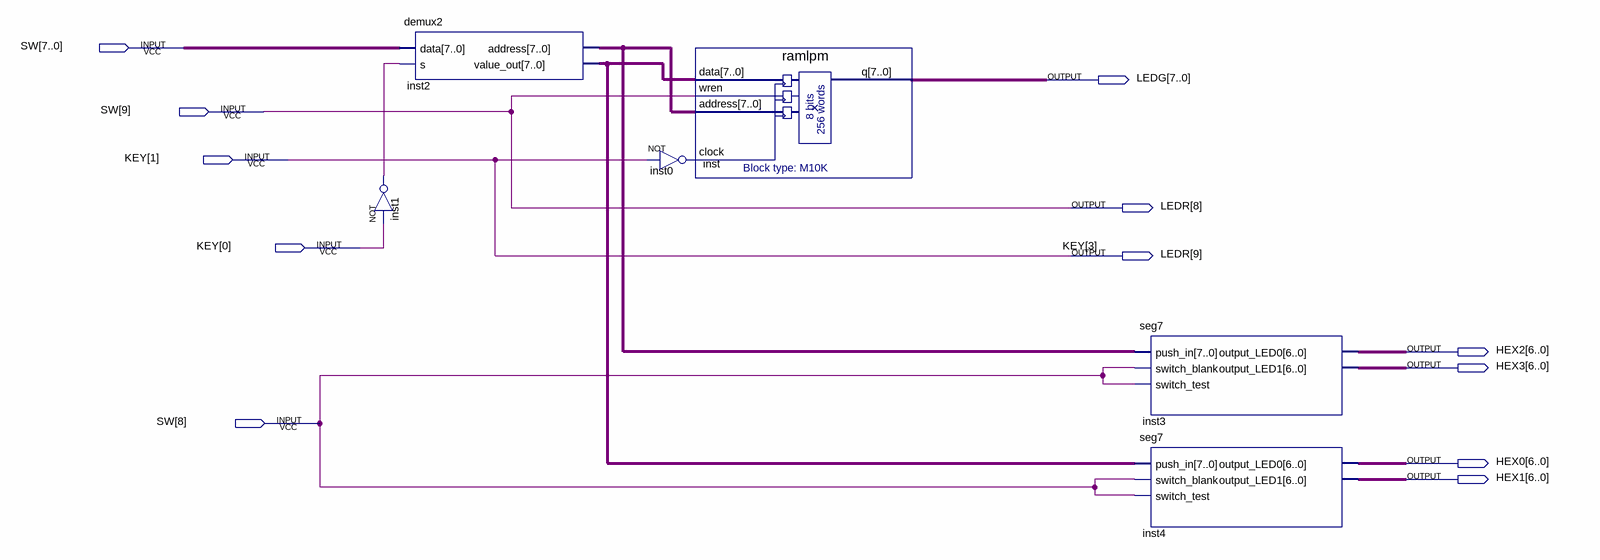
[diagram p0: schematic sheet]
// Quartus schematic lab6_board_tb.bdf as structural Verilog: 6 symbols, 12 pins
module lab6_board_tb (
  input  [9:0] SW,
  input  [1:0] KEY,
  output [7:0] LEDG,
  output [9:8] LEDR,
  output [6:0] HEX2,
  output [6:0] HEX3,
  output [6:0] HEX0,
  output [6:0] HEX1
);

  wire inst0_out, inst1_out;
  wire [7:0] inst2_address, inst2_value_out;

  not inst1 (inst1_out, KEY[0]);
  demux2 inst2 (.data(SW[7:0]), .s(inst1_out), .address(inst2_address), .value_out(inst2_value_out));
  ramlpm inst (.data(inst2_value_out), .wren(SW[9]), .address(inst2_address), .clock(inst0_out), .q(LEDG));
  not inst0 (inst0_out, KEY[1]);
  seg7 inst3 (
    .push_in(inst2_address), .switch_blank(SW[8]), .switch_test(SW[8]), .output_LED0(HEX2), .output_LED1(HEX3));
  seg7 inst4 (
    .push_in(inst2_value_out), .switch_blank(SW[8]), .switch_test(SW[8]), .output_LED0(HEX0),
    .output_LED1(HEX1));

  assign LEDR = {KEY[1], SW[9]};

  // Other names for the same wires on the sheet: KEY[3] = KEY[1]
endmodule
